# Altium project FlightSensorPrj.PrjPCB
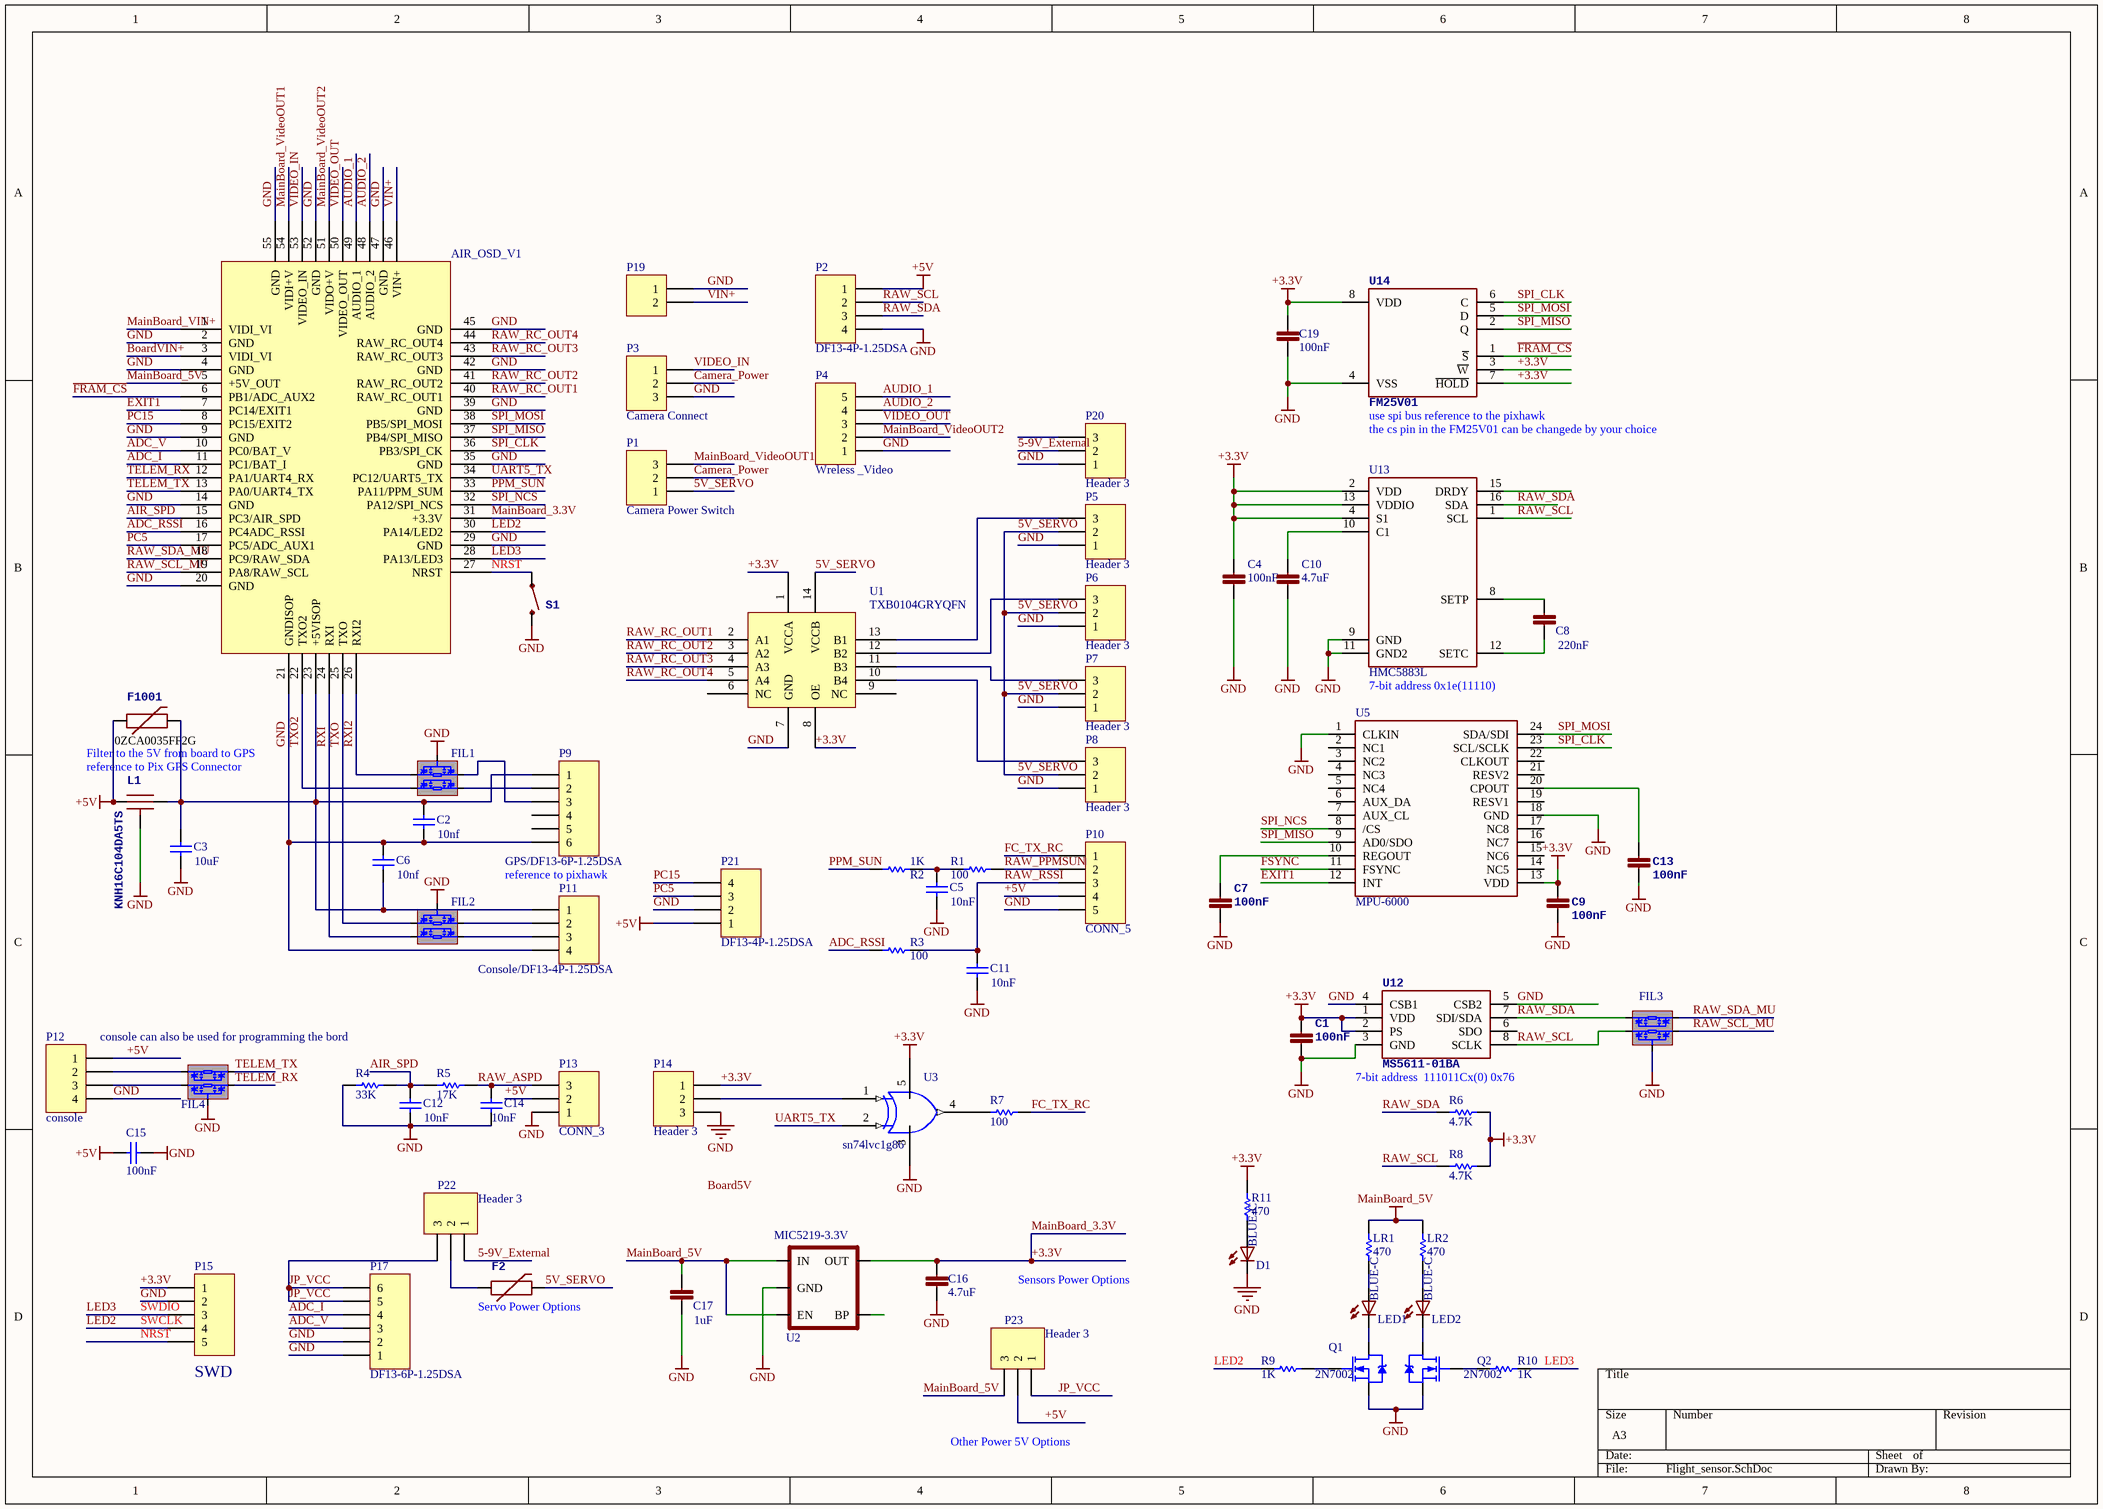
[diagram p0: Flight_sensor.SchDoc]
1 sheet, 73 parts. Net scope: global (net labels, ports and power ports of the same name join across sheets).
Board file: Flight_sensor.PcbDoc

## Sheet Flight_sensor.SchDoc
size A3

### Parts
AIR_OSD_V1  AIR_OSD_V1  [AIR_OSD_CON]  (value not drawn)
C1  100nF  [0402-CAP]
C2  10nf  [0402-CAP]
C3  10uF  [0805]
C4  100nF  [0402-CAP]
C5  10nF  [0402-CAP]
C6  10nf  [0402-CAP]
C7  100nF  [0402-CAP]
C8  220nF  [0402-CAP]
C9  100nF  [0402-CAP]
C10  4.7uF  [0805]
C11  10nF  [0402-CAP]
C12  10nF  [0402-CAP]
C13  100nF  [0402-CAP]
C14  10nF  [0402-CAP]
C15  100nF  [0402-CAP]
C16  4.7uF  [0805]
C17  1uF  [0805]
C19  100nF  [0402-CAP]
D1  BLUE-C  [LED-0603]
F2  >NAME: F2  [PTC-1206]  (hidden comment: 0ZCA0035FF2G)
F1001  >NAME: F1001  [PTC-1206]  (hidden comment: 0ZCA0035FF2G)
FIL1  IP4256CZ5-W,115  [SOT-665]  (value not drawn)
FIL2  IP4256CZ5-W,115  [SOT-665]  (value not drawn)
FIL3  IP4256CZ5-W,115  [SOT-665]  (value not drawn)
FIL4  IP4256CZ5-W,115  [SOT-665]  (value not drawn)
L1  >NAME: L1  [KYOCERA-KNH16-DA]  (hidden comment: KNH16C104DA5TS)
LED1  BLUE-C  [LED-0603]
LED2  BLUE-C  [LED-0603]
LR1  470  [0402-RES]
LR2  470  [0402-RES]
P1  Camera Power Switch  [3X1-NS]
P2  DF13-4P-1.25DSA  [DF13-4P-1.25DSA]
P3  Camera Connect  [HDR1X3]
P4  Wreless _Video  [HDR1X5]
P5  Header 3  [HDR1X3]
P6  Header 3  [HDR1X3]
P7  Header 3  [HDR1X3]
P8  Header 3  [HDR1X3]
P9  GPS/DF13-6P-1.25DSA  [PIXHAWK2_DF13-6P-1.25DSA]
P10  CONN_5  [DF13-5P-1.25DSA]
P11  Console/DF13-4P-1.25DSA  [DF13-4P-1.25DSA]
P12  console  [DF13-4P-1.25DSA]
P13  CONN_3  [HDR1X3]
P14  Header 3  [HDR1X3]
P15  SWD  [DF13-5P-1.25DSA]
P17  DF13-6P-1.25DSA  [PIXHAWK2_DF13-6P-1.25DSA]
P19  Header 2  [HDR1X2]  (value not drawn)
P20  Header 3  [HDR1X3]
P21  DF13-4P-1.25DSA  [HDR1X4]
P22  Header 3  [0402-S]
P23  Header 3  [0402-S]
Q1  2N7002  [2N7002]
Q2  2N7002  [2N7002]
R1  100  [0402-RES]
R2  1K  [0402-RES]
R3  100  [0402-RES]
R4  33K  [0402-RES]
R5  17K  [0402-RES]
R6  4.7K  [0402-RES]
R7  100  [0402-RES]
R8  4.7K  [0402-RES]
R9  1K  [0402-RES]
R10  1K  [0402-RES]
R11  470  [0402-RES]
S1  RESET  [EVQP7J01K]  (value not drawn)
U1  TXB0104GRYQFN  [RGY(S-PVQFN-N14)]
U2  MIC5219-3.3V  [SOT23-5]
U3  sn74lvc1g86
U5  MPU-6000  [MPU6000]
U12  MS5611-01BA  [MS5611-01BA]
U13  HMC5883L  [LPCC16]
U14  >NAME: U14  [SO08]  (hidden comment: FM25V01)

### Nets
+3.3V: AIR_OSD_V1.31(+3.3V) C1.2 C4.1 C9.2 C16.1 C19.2 P14.1 P15.1 R6.1 R8.1 R11.2 U1.1(VCCA) U1.8(OE) U2.5(OUT) U3.5(VDD) U5.13(VDD) U12.1(VDD) U12.2(PS) U13.2(VDD) U13.4(S1) U13.13(VDDIO) U14.3(~{W}) U14.7(~{HOLD}) U14.8(VDD)  [also labelled MainBoard_3.3V]
+5V: C15.2 F1001.1 L1.P$1 P2.1 P10.4 P12.1 P13.2 P21.1 P23.2
GND: AIR_OSD_V1.2(GND) AIR_OSD_V1.4(GND) AIR_OSD_V1.9(GND) AIR_OSD_V1.14(GND) AIR_OSD_V1.20(GND) AIR_OSD_V1.21(GNDISOP) AIR_OSD_V1.29(GND) AIR_OSD_V1.35(GND) AIR_OSD_V1.39(GND) AIR_OSD_V1.42(GND) AIR_OSD_V1.45(GND) AIR_OSD_V1.47(GND) AIR_OSD_V1.52(GND) AIR_OSD_V1.55(GND) C1.1 C2.1 C3.1 C4.2 C5.1 C6.2 C7.1 C9.1 C10.2 C11.1 C12.1 C13.1 C14.1 C15.1 C16.2 C17.2 C19.1 D1.C FIL1.2(PAD) FIL2.2(PAD) FIL3.2(PAD) FIL4.2(PAD) L1.P$3_P$4_P$5(P$3) P2.4 P3.3 P4.1 P5.1 P6.1 P7.1 P8.1 P9.6 P10.5 P11.4 P12.4 P13.1 P14.3 P15.2 P17.1 P17.2 P19.1 P20.1 P21.2 Q1.3(S) Q2.3(S) R4.2 S1.B3 U1.7(GND) U2.2(GND) U3.3(GND) U5.1(CLKIN) U5.18(GND) U12.3(GND) U12.4(CSB1) U12.5(CSB2) U13.9(GND) U13.11(GND2) U14.4(VSS)
MainBoard_5V: AIR_OSD_V1.5(+5V_OUT) C17.1 LR1.2 LR2.2 P23.3 U2.1(IN) U2.3(EN)
5-9V_External: P20.2 P22.1
5V_SERVO: F2.2 P1.1 P5.2 P6.2 P7.2 P8.2 U1.14(VCCB)
ADC_I: AIR_OSD_V1.11(PC1/BAT_I) P17.4
ADC_RSSI: AIR_OSD_V1.16(PC4ADC_RSSI) R3.2
ADC_V: AIR_OSD_V1.10(PC0/BAT_V) P17.3
AIR_SPD: AIR_OSD_V1.15(PC3/AIR_SPD) C12.2 R4.1 R5.2
AUDIO_1: AIR_OSD_V1.49(AUDIO_1) P4.5
AUDIO_2: AIR_OSD_V1.48(AUDIO_2) P4.4
BoardVIN+: AIR_OSD_V1.3(VIDI_VI)
Camera_Power: P1.2 P3.2
EXIT1: AIR_OSD_V1.7(PC14/EXIT1) U5.12(INT)
~{FRAM_CS}: AIR_OSD_V1.6(PB1/ADC_AUX2) U14.1(~{S})
FC_TX_RC: P10.1 R7.1
FSYNC: U5.11(FSYNC)
JP_VCC: P17.5 P17.6 P22.3 P23.1
LED2: AIR_OSD_V1.30(PA14/LED2) P15.4 R9.2  [also labelled SWCLK]
LED3: AIR_OSD_V1.28(PA13/LED3) P15.3 R10.1  [also labelled SWDIO]
MainBoard_VideoOUT1: AIR_OSD_V1.54(VIDI+V) P1.3
MainBoard_VideoOUT2: AIR_OSD_V1.51(VIDO+V) P4.2
MainBoard_VIN+: AIR_OSD_V1.1(VIDI_VI)
NRST: AIR_OSD_V1.27(NRST) P15.5 S1.A1
PC5: AIR_OSD_V1.17(PC5/ADC_AUX1) P21.3
PC15: AIR_OSD_V1.8(PC15/EXIT2) P21.4
PPM_SUN: AIR_OSD_V1.33(PA11/PPM_SUM) R2.2
RAW_ASPD: C14.2 P13.3 R5.1
RAW_PPMSUN: P10.2 R1.1
RAW_RC_OUT1: AIR_OSD_V1.40(RAW_RC_OUT1) U1.2(A1)
RAW_RC_OUT2: AIR_OSD_V1.41(RAW_RC_OUT2) U1.3(A2)
RAW_RC_OUT3: AIR_OSD_V1.43(RAW_RC_OUT3) U1.4(A3)
RAW_RC_OUT4: AIR_OSD_V1.44(RAW_RC_OUT4) U1.5(A4)
RAW_RSSI: C11.2 P10.3 R3.1
RAW_SCL: FIL3.5 P2.2 R8.2 U12.8(SCLK) U13.1(SCL)
RAW_SCL_MU: AIR_OSD_V1.19(PA8/RAW_SCL) FIL3.1
RAW_SDA: FIL3.4 P2.3 R6.2 U12.7(SDI/SDA) U13.16(SDA)
RAW_SDA_MU: AIR_OSD_V1.18(PC9/RAW_SDA) FIL3.3
RXI: AIR_OSD_V1.24(RXI) FIL2.3
RXI2: AIR_OSD_V1.26(RXI2) FIL1.1
SPI_CLK: AIR_OSD_V1.36(PB3/SPI_CK) U5.23(SCL/SCLK) U14.6(C)
SPI_MISO: AIR_OSD_V1.37(PB4/SPI_MISO) U5.9(AD0/SDO) U14.2(Q)
SPI_MOSI: AIR_OSD_V1.38(PB5/SPI_MOSI) U5.24(SDA/SDI) U14.5(D)
SPI_NCS: AIR_OSD_V1.32(PA12/SPI_NCS) U5.8(/CS)
TELEM_RX: AIR_OSD_V1.12(PA1/UART4_RX) FIL4.1
TELEM_TX: AIR_OSD_V1.13(PA0/UART4_TX) FIL4.3
TXO: AIR_OSD_V1.25(TXO) FIL2.1
TXO2: AIR_OSD_V1.22(TXO2) FIL1.3
UART5_TX: AIR_OSD_V1.34(PC12/UART5_TX) U3.2
VIDEO_IN: AIR_OSD_V1.53(VIDEO_IN) P3.1
VIDEO_OUT: AIR_OSD_V1.50(VIDEO_OUT) P4.3
VIN+: AIR_OSD_V1.46(VIN+) P19.2
NetAIR_OSD_V1_23: AIR_OSD_V1.23(+5VISOP) C2.2 C3.2 C6.1 F1001.2 L1.P$2 P9.1 P11.1
NetC5_2: C5.2 R1.2 R2.1
NetC7_2: C7.2 U5.10(REGOUT)
NetC8_1: C8.1 U13.8(SETP)
NetC8_2: C8.2 U13.12(SETC)
NetC10_1: C10.1 U13.10(C1)
NetC13_2: C13.2 U5.20(CPOUT)
NetD1_A: D1.A R11.1
NetF2_1: F2.1 P22.2
NetFIL1_4: FIL1.4 P9.2
NetFIL1_5: FIL1.5 P9.3
NetFIL2_4: FIL2.4 P11.3
NetFIL2_5: FIL2.5 P11.2
NetFIL4_4: FIL4.4 P12.2
NetFIL4_5: FIL4.5 P12.3
NetLED1_A: LED1.A LR1.1
NetLED1_C: LED1.C Q1.2(D)
NetLED2_A: LED2.A LR2.1
NetLED2_C: LED2.C Q2.2(D)
NetP5_3: P5.3 U1.13(B1)
NetP6_3: P6.3 U1.12(B2)
NetP7_3: P7.3 U1.11(B3)
NetP8_3: P8.3 U1.10(B4)
NetP14_2: P14.2 U3.1
NetQ1_1: Q1.1(G) R9.1
NetQ2_1: Q2.1(G) R10.2
NetR7_2: R7.2 U3.4

Not connected (* = marked no-connect by the designer): P9 4 5; P20 3; U1 6(NC) 9(NC); U2 4(BP); U5 2(NC1) 3(NC2) 4(NC3) 5(NC4) 6(AUX_DA) 7(AUX_CL) 14(NC5) 15(NC6) 16(NC7) 17(NC8) 19(RESV1) 21(RESV2) 22(CLKOUT); U12 6(SDO); U13 15(DRDY)

### Notes on the sheet
- (near U14) use spi bus reference to the pixhawk
- the cs pin in the FM25V01 can be changede by your choice
- 7-bit address 0x1e(11110)
- Filter to the 5V from board to GPS
- reference to Pix GPS Connector
- (near F1001) 0ZCA0035FF2G
- reference to pixhawk
- console can also be used for programming the bord
- 7-bit address  111011Cx(0) 0x76
- (near F2) Servo Power Options
- Sensors Power Options
- Other Power 5V Options
- Labels drawn without touching a wire or pin: Board5V

### Library data of the parts
C1 C4 C7-C9 C13 C16 C17 C19 = CAP0402-CAP
C2 C3 C5 C6 C11 C12 C14 C15 = Cap: Capacitor
C10 = CAP0805
D1 LED1 LED2 = LED0603
F2 F1001 = PTCSMD: <b>Resettable Fuse PTC</b> / Resettable Fuse. Spark Fun Electronics SKU : COM-08357; PARTNO: 0ZCA0035FF2G
FIL1-FIL4 = RF Filter 100R 30pF: IP4256CZ5-W,115 2 channel, 100R, 30pF, RF ESD Filter; Manufacturer: Generic Components; Class: Passive; Supplier 1: Digi-Key; Supplier Part Number 1: 568-5871-1-ND; ComponentLink2Description: Datasheet; LatestRevisionDate: 1-Nov-2010; LatestRevisionNote: Released OpenPilot Lib; Published: 1-Nov-2010; Publisher: The OpenPilot Project
L1 = KNH16C104DA5TS: Kyocera KNH16C104DA5TS EMI filter; PARTNO: KNH16C104DA5TS; >VALUE: KNH16C104DA5TS
LR1 LR2 R1-R11 = Res1: Resistor
P1 P3 P5-P8 P13 P14 P20 P22 P23 = Header 3: Header, 3-Pin
  P1 P3 P5-P8 P14 P20 P22 P23: LatestRevisionDate: 17-Jul-2002; LatestRevisionNote: Re-released for DXP Platform.; Publisher: Altium Limited
P2 P11 P12 P21 = Header 4: Header, 4-Pin; LatestRevisionDate: 17-Jul-2002; LatestRevisionNote: Re-released for DXP Platform.; Publisher: Altium Limited
P4 P10 P15 = Header 5: Header, 5-Pin
P9 P17 = Header 6: Header, 6-Pin
  P9: LatestRevisionDate: 17-Jul-2002; LatestRevisionNote: Re-released for DXP Platform.; Publisher: Altium Limited
P19 = Header 2: 接插件; LatestRevisionDate: 17-Jul-2002; LatestRevisionNote: Re-released for DXP Platform.; Publisher: Altium Limited
Q1 Q2 = IRF840: CQ-IRF840
S1 = SWITCH-MOMENTARY-2
U1 = TXB0104UQFN
U2 = V_REG_LDOSMD
U5 = MPU-3000
U14 = FM25V01: <b>FM25V01 128Kb Serial 3V F-RAM Memory</b>; PARTNO: FM25V01-G; DATASHEET: http://www.ramtron.com/files/datasheets/FM25V01_ds.pdf; LINK: http://www.digikey.com/product-detail/en/FM25V01-GTR/1140-1026-1-ND/2809832; MFGPN: FM25V01; >VALUE: FM25V01